# Altium project SOT-23,SOT-28,SOT-323.PrjPcb
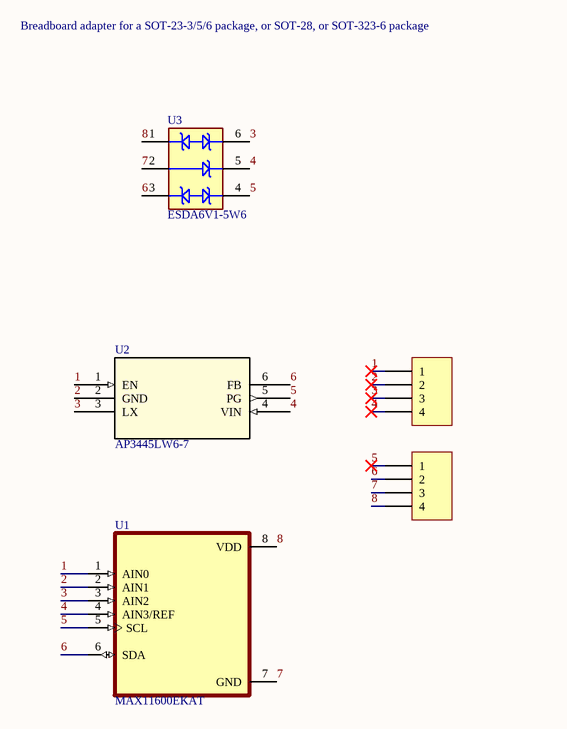
[diagram p0: Schematic.SchDoc]
1 sheet, 5 parts. Net scope: global (net labels, ports and power ports of the same name join across sheets).
Board file: PCB.PcbDoc

## Sheet Schematic.SchDoc
size A4

### Parts
P1  Header 4  [HDR1X4]  (value not drawn)
P2  Header 4  [HDR1X4]  (value not drawn)
U1  MAX11600EKAT  [SOT65P280X145-8N]
U2  AP3445LW6-7  [SOT26_AP3445_DIO]
U3  ESDA6V1-5W6  [DIO_ESDA6V1-5W6]

### Nets
1: P1.1 U1.1(AIN0) U2.1(EN)
2: P1.2 U1.2(AIN1) U2.2(GND)
3: P1.3 U1.3(AIN2) U2.3(LX) U3.6
4: P1.4 U1.4(AIN3/REF) U2.4(VIN) U3.5
5: P2.1 U1.5(SCL) U2.5(PG) U3.4
6: P2.2 U1.6(SDA) U2.6(FB) U3.3
7: P2.3 U1.7(GND) U3.2
8: P2.4 U1.8(VDD) U3.1

### Notes on the sheet
- Breadboard adapter for a SOT-23-3/5/6 package, or SOT-28, or SOT-323-6 package

### Library data of the parts
P1 P2 = Header 4: Header, 4-Pin; LatestRevisionDate: 17-Jul-2002; LatestRevisionNote: Re-released for DXP Platform.; Publisher: Altium Limited
U1 = MAX11600EKAT: 8 Bit Analog to Digital Converter 2, 4 Input 1 SAR SOT-23-8; MP: MAX11600EKA+T; MF: Maxim Integrated; SnapEDA_Link: https://www.snapeda.com/parts/MAX11600EKA+T/Maxim%20Integrated/view-part/609916/?ref=snap; Value: *; Availability: In Stock; Purchase-URL: https://pricing.snapeda.com/search/part/MAX11600EKA+T/?ref=eda; Check_prices: https://www.snapeda.com/parts/MAX11600EKA+T/Maxim%20Integrated/view-part/609916/?ref=eda; Package: SOT-8 Maxim; Price: None
U2 = AP3445LW6-7: No Description Available; Mfr_Name: Diodes Inc; Copyright: Copyright (C) 2024 Ultra Librarian. All rights reserved.; Manufacturer_Part_Number: AP3445LW6-7; RefDes: RefDes; Type: DEV
U3 = ESDA6V1-5W6: - Clamp - Ipp Tvs Diode Surface Mount SOT-323-6L; MF: STMicroelectronics; Package: SOT-323 STMicroelectronics; Price: None; Check_prices: https://www.snapeda.com/parts/ESDA6V1-5W6/STMicroelectronics/view-part/?ref=eda; Value: *; SnapEDA_Link: https://www.snapeda.com/parts/ESDA6V1-5W6/STMicroelectronics/view-part/?ref=snap; MP: ESDA6V1-5W6; Availability: In Stock; Purchase-URL: https://pricing.snapeda.com/search?q=ESDA6V1-5W6&ref=eda